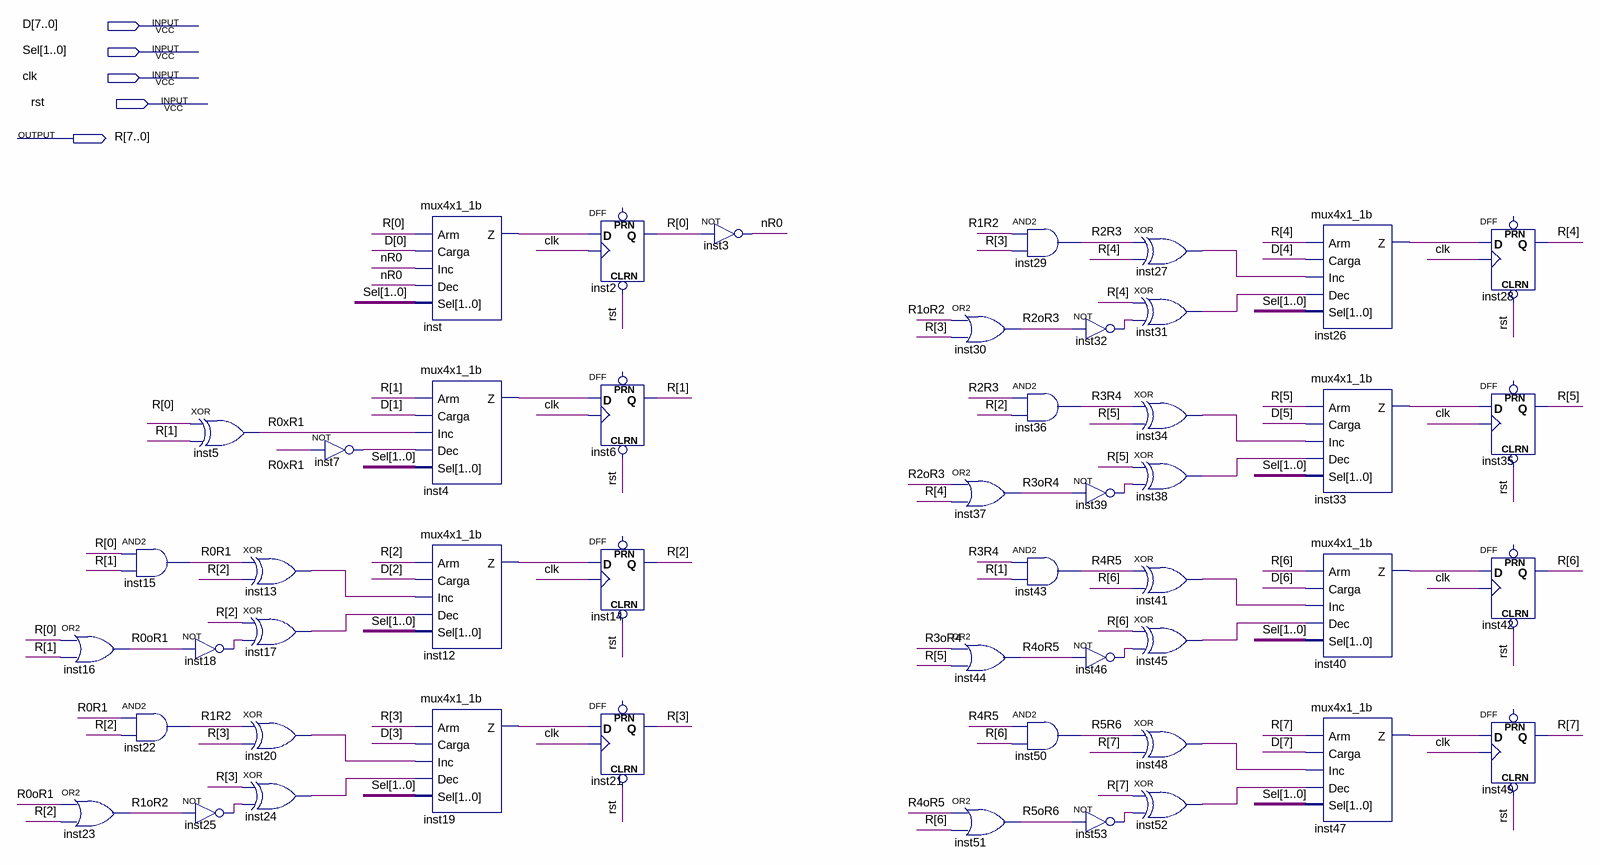
[diagram p0: schematic sheet]
// Quartus schematic contador8b.bdf as structural Verilog: 49 symbols, 5 pins
module contador8b (
  input  [7:0] D,
  input  [1:0] Sel,
  input  clk,
  input  rst,
  output [7:0] R
);

  wire inst4_z, inst7_out, inst12_z, inst13_out, inst17_out, inst18_out, inst19_z, inst20_out, inst24_out,
       inst25_out, inst26_z, inst27_out, inst31_out, inst32_out, inst33_z, inst34_out, inst38_out,
       inst39_out, inst40_z, inst41_out, inst45_out, inst46_out, inst47_z, inst48_out, inst52_out,
       inst53_out, inst_z, nR0, R0oR1, R0R1, R0xR1, R1oR2, R1R2, R2oR3, R2R3, R3oR4, R3R4, R4oR5, R4R5,
       R5oR6, R5R6;

  or inst16 (R0oR1, R[0], R[1]);
  or inst23 (R1oR2, R0oR1, R[2]);
  and inst15 (R0R1, R[0], R[1]);
  and inst22 (R1R2, R0R1, R[2]);
  xor inst5 (R0xR1, R[0], R[1]);
  xor inst13 (inst13_out, R0R1, R[2]);
  xor inst17 (inst17_out, R[2], inst18_out);
  not inst18 (inst18_out, R0oR1);
  xor inst20 (inst20_out, R1R2, R[3]);
  xor inst24 (inst24_out, R[3], inst25_out);
  not inst25 (inst25_out, R1oR2);
  not inst7 (inst7_out, R0xR1);
  mux4x1_1b inst (.Arm(R[0]), .Carga(D[0]), .Inc(nR0), .Dec(nR0), .Sel(Sel), .Z(inst_z));
  mux4x1_1b inst4 (.Arm(R[1]), .Carga(D[1]), .Inc(R0xR1), .Dec(inst7_out), .Sel(Sel), .Z(inst4_z));
  mux4x1_1b inst12 (.Arm(R[2]), .Carga(D[2]), .Inc(inst13_out), .Dec(inst17_out), .Sel(Sel), .Z(inst12_z));
  mux4x1_1b inst19 (.Arm(R[3]), .Carga(D[3]), .Inc(inst20_out), .Dec(inst24_out), .Sel(Sel), .Z(inst19_z));
  DFF inst2 (.CLRN(rst), .CLK(clk), .D(inst_z), .Q(R[0]));  // open: PRN
  DFF inst6 (.CLRN(rst), .CLK(clk), .D(inst4_z), .Q(R[1]));  // open: PRN
  DFF inst14 (.CLRN(rst), .CLK(clk), .D(inst12_z), .Q(R[2]));  // open: PRN
  DFF inst21 (.CLRN(rst), .CLK(clk), .D(inst19_z), .Q(R[3]));  // open: PRN
  not inst3 (nR0, R[0]);
  or inst30 (R2oR3, R1oR2, R[3]);
  or inst37 (R3oR4, R2oR3, R[4]);
  or inst44 (R4oR5, R3oR4, R[5]);
  or inst51 (R5oR6, R4oR5, R[6]);
  and inst29 (R2R3, R1R2, R[3]);
  not inst32 (inst32_out, R2oR3);
  and inst36 (R3R4, R2R3, R[2]);
  not inst39 (inst39_out, R3oR4);
  and inst43 (R4R5, R3R4, R[1]);
  not inst46 (inst46_out, R4oR5);
  and inst50 (R5R6, R4R5, R[6]);
  not inst53 (inst53_out, R5oR6);
  xor inst27 (inst27_out, R2R3, R[4]);
  xor inst31 (inst31_out, R[4], inst32_out);
  xor inst34 (inst34_out, R3R4, R[5]);
  xor inst38 (inst38_out, R[5], inst39_out);
  xor inst41 (inst41_out, R4R5, R[6]);
  xor inst45 (inst45_out, R[6], inst46_out);
  xor inst48 (inst48_out, R5R6, R[7]);
  xor inst52 (inst52_out, R[7], inst53_out);
  mux4x1_1b inst26 (.Arm(R[4]), .Carga(D[4]), .Inc(inst27_out), .Dec(inst31_out), .Sel(Sel), .Z(inst26_z));
  mux4x1_1b inst33 (.Arm(R[5]), .Carga(D[5]), .Inc(inst34_out), .Dec(inst38_out), .Sel(Sel), .Z(inst33_z));
  mux4x1_1b inst40 (.Arm(R[6]), .Carga(D[6]), .Inc(inst41_out), .Dec(inst45_out), .Sel(Sel), .Z(inst40_z));
  mux4x1_1b inst47 (.Arm(R[7]), .Carga(D[7]), .Inc(inst48_out), .Dec(inst52_out), .Sel(Sel), .Z(inst47_z));
  DFF inst28 (.CLRN(rst), .CLK(clk), .D(inst26_z), .Q(R[4]));  // open: PRN
  DFF inst35 (.CLRN(rst), .CLK(clk), .D(inst33_z), .Q(R[5]));  // open: PRN
  DFF inst42 (.CLRN(rst), .CLK(clk), .D(inst40_z), .Q(R[6]));  // open: PRN
  DFF inst49 (.CLRN(rst), .CLK(clk), .D(inst47_z), .Q(R[7]));  // open: PRN
endmodule
